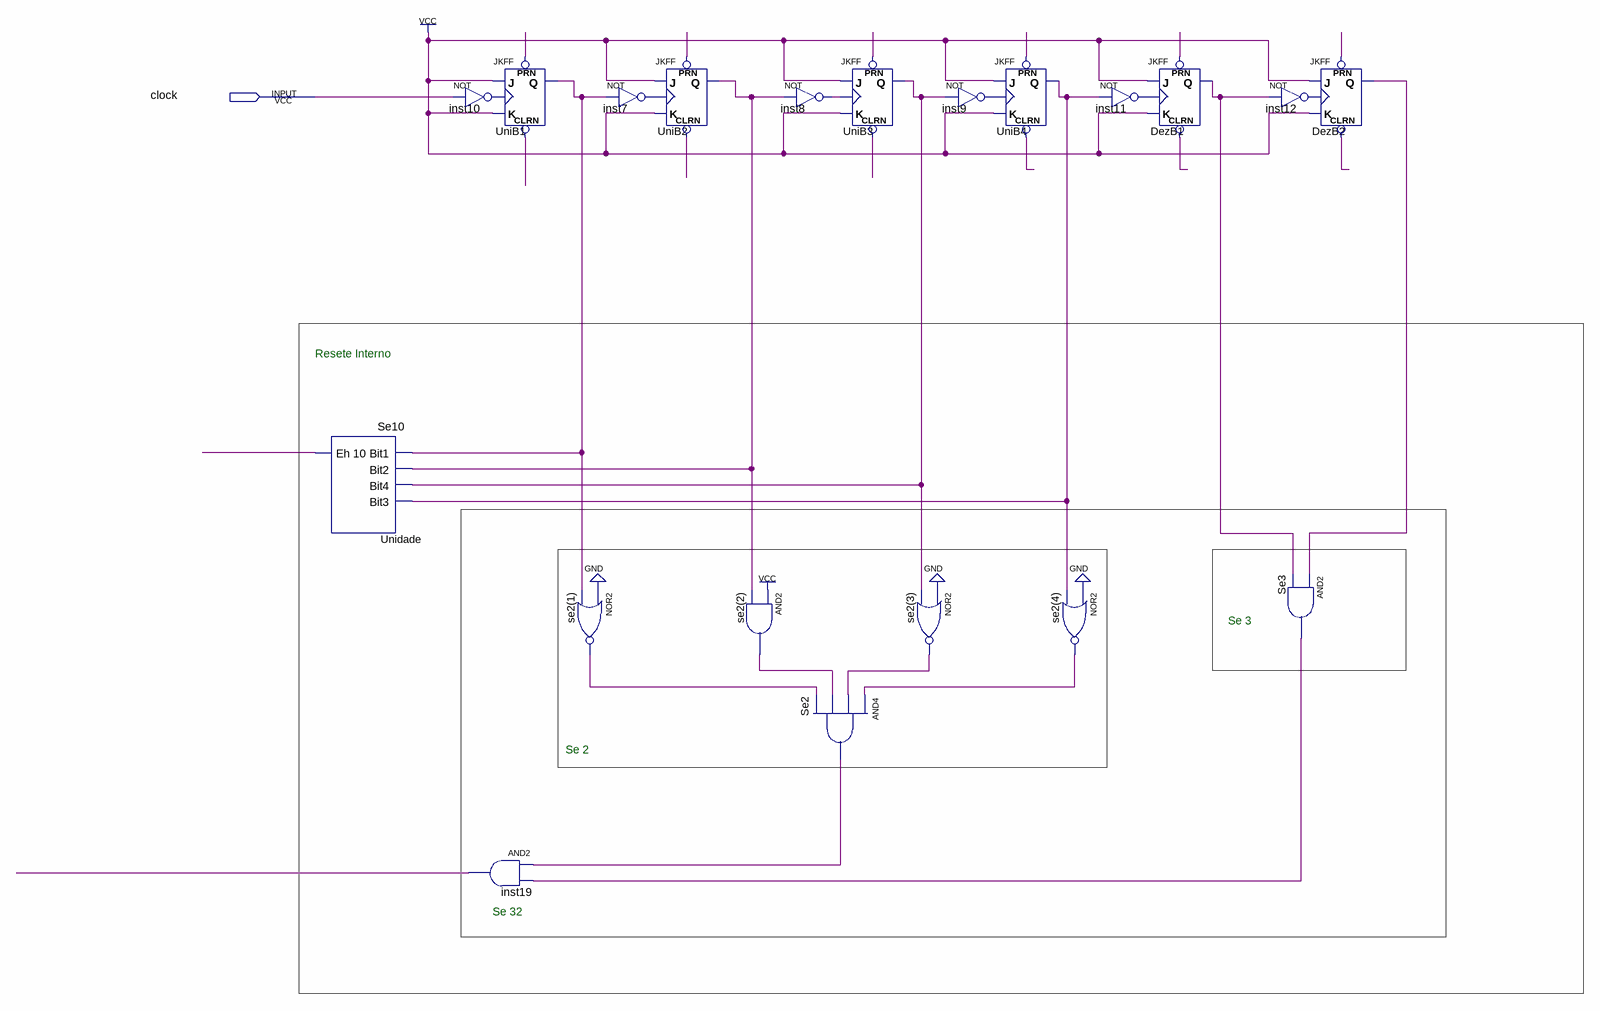
[diagram p0: schematic sheet]
// Quartus schematic contador31.bdf as structural Verilog: 20 symbols, 1 pins
module contador31 (
  input  clock
);

  wire DezB1_q, DezB2_q, inst7_out, inst8_out, inst9_out, inst11_out, inst19_out, se2_1__out, se2_2__out,
       se2_3__out, se2_4__out, Se2_out, Se3_out, undriven, undriven_2, undriven_3, undriven_4, undriven_5,
       undriven_6, undriven_7, undriven_8, undriven_9, undriven_10, undriven_11, undriven_12, UniB1_q,
       UniB2_q, UniB3_q, UniB4_q, Unidade_eh_10;

  Se10 Unidade (.Bit1(UniB1_q), .Bit2(UniB2_q), .Bit4(UniB3_q), .Bit3(UniB4_q), .\Eh_10 (Unidade_eh_10));
  // NOT inst10 has open pins: IN=clock, OUT=open
  and inst19 (inst19_out, Se2_out, Se3_out);
  JKFF UniB1 (.PRN(undriven), .CLRN(undriven_10), .K(1'b1), .J(1'b1), .Q(UniB1_q));  // open: CLK
  not inst7 (inst7_out, UniB1_q);
  nor \se2(1)  (se2_1__out, 1'b0, UniB1_q);
  JKFF UniB2 (.PRN(undriven_2), .CLRN(undriven_11), .K(1'b1), .J(1'b1), .CLK(inst7_out), .Q(UniB2_q));
  and \se2(2)  (se2_2__out, 1'b1, UniB2_q);
  not inst8 (inst8_out, UniB2_q);
  and Se2 (Se2_out, se2_4__out, se2_3__out, se2_2__out, se2_1__out);
  JKFF UniB3 (.PRN(undriven_3), .CLRN(undriven_12), .K(1'b1), .J(1'b1), .CLK(inst8_out), .Q(UniB3_q));
  nor \se2(3)  (se2_3__out, 1'b0, UniB3_q);
  JKFF UniB4 (.PRN(undriven_4), .CLRN(undriven_7), .K(1'b1), .J(1'b1), .CLK(inst9_out), .Q(UniB4_q));
  not inst9 (inst9_out, UniB3_q);
  nor \se2(4)  (se2_4__out, 1'b0, UniB4_q);
  not inst11 (inst11_out, UniB4_q);
  JKFF DezB1 (.PRN(undriven_5), .CLRN(undriven_8), .K(1'b1), .J(1'b1), .CLK(inst11_out), .Q(DezB1_q));
  JKFF DezB2 (.PRN(undriven_6), .CLRN(undriven_9), .K(1'b1), .J(1'b1), .Q(DezB2_q));  // open: CLK
  // NOT inst12 has open pins: IN=DezB1_q, OUT=open
  and Se3 (Se3_out, DezB2_q, DezB1_q);

  // Notes on the sheet:
  //   Resete Interno
  //   Se 3
  //   Se 2
  //   Se 32
endmodule
